# EAGLE schematic Node (EAGLE 9.5.2)
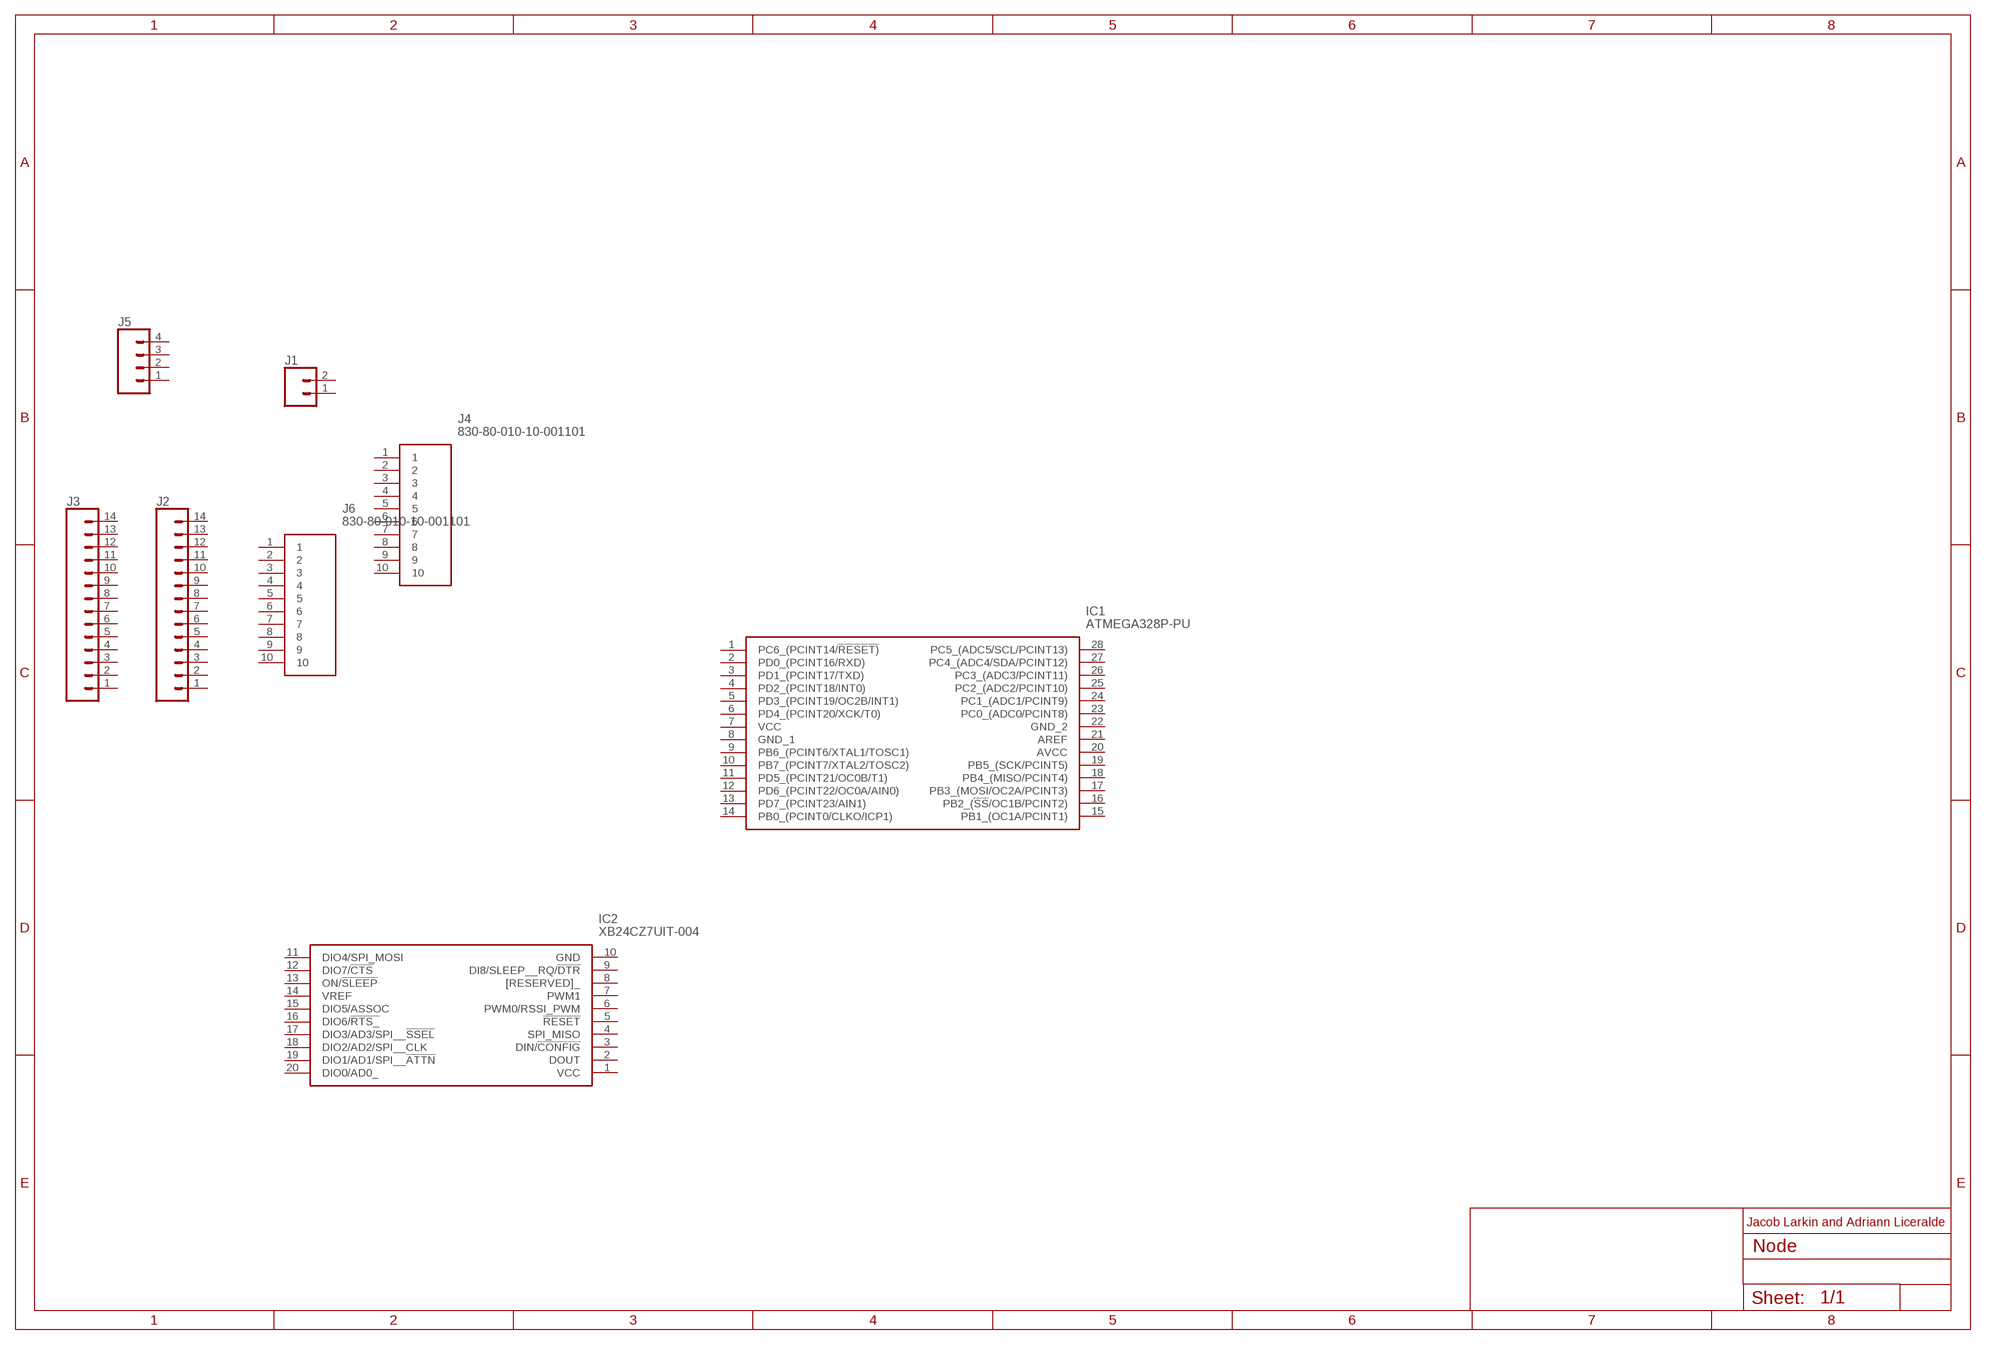
[diagram p0: schematic, sheet 1]

## Parts
IC1  ATMEGA328P-PU  [DIP794W53P254L3467H457Q28N]
IC2  XB24CZ7UIT-004  [XB24CZ7UIT004]
J1  CONN_02JST-PTH-2  [JST-2-PTH]
J2  CONN_14  [1X14]
J3  CONN_14  [1X14]
J4  830-80-010-10-001101  [HDRV10W50P0X200_1X10_2000X220X]
J5  CONN_04JST-PTH  [JST-4-PTH]
J6  830-80-010-10-001101  [HDRV10W50P0X200_1X10_2000X220X]
Unconnected: IC1.1(PC6_(PCINT14/!RESET)) IC1.2(PD0_(PCINT16/RXD)) IC1.3(PD1_(PCINT17/TXD)) IC1.4(PD2_(PCINT18/INT0)) IC1.5(PD3_(PCINT19/OC2B/INT1)) IC1.6(PD4_(PCINT20/XCK/T0)) IC1.7(VCC) IC1.8(GND_1) IC1.9(PB6_(PCINT6/XTAL1/TOSC1)) IC1.10(PB7_(PCINT7/XTAL2/TOSC2)) IC1.11(PD5_(PCINT21/OC0B/T1)) IC1.12(PD6_(PCINT22/OC0A/AIN0)) IC1.13(PD7_(PCINT23/AIN1)) IC1.14(PB0_(PCINT0/CLKO/ICP1)) IC1.15(PB1_(OC1A/PCINT1)) IC1.16(PB2_(!SS!/OC1B/PCINT2)) IC1.17(PB3_(MOSI/OC2A/PCINT3)) IC1.18(PB4_(MISO/PCINT4)) IC1.19(PB5_(SCK/PCINT5)) IC1.20(AVCC) IC1.21(AREF) IC1.22(GND_2) IC1.23(PC0_(ADC0/PCINT8)) IC1.24(PC1_(ADC1/PCINT9)) IC1.25(PC2_(ADC2/PCINT10)) IC1.26(PC3_(ADC3/PCINT11)) IC1.27(PC4_(ADC4/SDA/PCINT12)) IC1.28(PC5_(ADC5/SCL/PCINT13)) IC2.1(VCC) IC2.2(DOUT) IC2.3(DIN/!CONFIG) IC2.4(SPI_MISO) IC2.5(!RESET) IC2.6(PWM0/RSSI_PWM) IC2.7(PWM1) IC2.8([RESERVED]_) IC2.9(DI8/SLEEP__RQ/!DTR) IC2.10(GND) IC2.11(DIO4/SPI_MOSI) IC2.12(DIO7/!CTS) IC2.13(ON/!SLEEP) IC2.14(VREF) IC2.15(DIO5/ASSOC) IC2.16(DIO6/!RTS_) IC2.17(DIO3/AD3/SPI__!SSEL) IC2.18(DIO2/AD2/SPI__CLK) IC2.19(DIO1/AD1/SPI__!ATTN) IC2.20(DIO0/AD0_) J1.1 J1.2 J2.1 J2.2 J2.3 J2.4 J2.5 J2.6 J2.7 J2.8 J2.9 J2.10 J2.11 J2.12 J2.13 J2.14 J3.1 J3.2 J3.3 J3.4 J3.5 J3.6 J3.7 J3.8 J3.9 J3.10 J3.11 J3.12 J3.13 J3.14 J4.1 J4.2 J4.3 J4.4 J4.5 J4.6 J4.7 J4.8 J4.9 J4.10 J5.1 J5.2 J5.3 J5.4 J6.1 J6.2 J6.3 J6.4 J6.5 J6.6 J6.7 J6.8 J6.9 J6.10

## Notes on the sheet
- Jacob Larkin and Adriann Liceralde

## Library data of the parts
IC1 = SamacSys_Parts:ATMEGA328P-PU: MICROCHIP - ATMEGA328P-PU. - MICROCONTROLLER MCU, 8 BIT, ATMEGA, 20MHZ, DIP-28 Source: Datasheet <http://ww1.microchip.com/downloads/en/DeviceDoc/Atmel-42735-8-bit-AVR-Microcontroller-ATmega328-328P_Datasheet.pdf>; ALLIED_NUMBER: 70332157; ALLIED_PRICE-STOCK: https://www.alliedelec.com/microchiptechnologyinc-atmega328p-pu/70332157/; DESCRIPTION: MICROCHIP - ATMEGA328P-PU. - MICROCONTROLLER MCU, 8 BIT, ATMEGA, 20MHZ, DIP-28; HEIGHT: 4.572mm; MANUFACTURER_NAME: Microchip; MANUFACTURER_PART_NUMBER: ATMEGA328P-PU; MOUSER_PART_NUMBER: 556-ATMEGA328P-PU; MOUSER_PRICE-STOCK: https://www.mouser.com/Search/Refine.aspx?Keyword=556-ATMEGA328P-PU; RS_PART_NUMBER: 9222142P; RS_PRICE-STOCK: http://uk.rs-online.com/web/p/products/9222142P
IC2 = SamacSys_Parts:XB24CZ7UIT-004: DIGI INTERNATIONAL - XB24CZ7UIT-004 - RF Transceiver Module, DSSS Modulation, 250Kbps, 2.4GHz, -102dBm, 2.1V to 3.6V, SPI, UART Source: Datasheet <https://componentsearchengine.com/Datasheets/1/XB24CZ7UIT-004.pdf>; DESCRIPTION: DIGI INTERNATIONAL - XB24CZ7UIT-004 - RF Transceiver Module, DSSS Modulation, 250Kbps, 2.4GHz, -102dBm, 2.1V to 3.6V, SPI, UART; HEIGHT: 7.874mm; MANUFACTURER_NAME: Digi International; MANUFACTURER_PART_NUMBER: XB24CZ7UIT-004; MOUSER_PART_NUMBER: 888-XB24CZ7UIT-004; MOUSER_PRICE-STOCK: https://www.mouser.com/Search/Refine.aspx?Keyword=888-XB24CZ7UIT-004
J1 = SparkFun-Connectors:CONN_02: Multi connection point. Often used as Generic Header-pin footprint for 0.1 inch spaced/style header connections On any of the 0.1 inch spaced packages, you can populate with these: Break Away Headers - Straight <https://www.sparkfun.com/products/116> (PRT-00116) Break Away Male Headers - Right Angle <https://www.sparkfun.com/products/553> (PRT-00553) Female Headers <https://www.sparkfun.com/products/115> (PRT-00115) Break Away Headers - Machine Pin <https://www.sparkfun.com/products/117> (PRT-00117) Break Away Female Headers - Swiss Machine Pin <https://www.sparkfun.com/products/743> (PRT-00743) For SCREWTERMINALS and SPRING TERMINALS visit here: Screw Terimnals on SparkFun.com <https://www.sparkfun.com/search/results?term=Screw+Terminals> (5mm/3.5mm/2.54mm spacing) This device is also useful as a general connection point to wire up your design to another part of your project. Our various solder wires solder well into these plated through hole pads. Hook-Up Wire - Assortment (Stranded, 22 AWG) <https://www.sparkfun.com/products/11375> (PRT-11375) Hook-Up Wire - Assortment (Solid Core, 22 AWG) <https://www.sparkfun.com/products/11367> (PRT-11367) View the entire wire category on our website here <https://www.sparkfun.com/categories/141> Special notes: Molex polarized connector foot print use with: PRT-08233 with associated crimp pins and housings. 2.54_SCREWTERM for use with PRT-10571. 3.5mm Screw Terminal footprints for PRT-08084 5mm Screw Terminal footprints for use with PRT-08432; PROD_ID: CONN-09863; SKU: PRT-09914
J2 J3 = SparkFun-Connectors:CONN_14: Multi connection point. Often used as Generic Header-pin footprint for 0.1 inch spaced/style header connections On any of the 0.1 inch spaced packages, you can populate with these: Break Away Headers - Straight <https://www.sparkfun.com/products/116> (PRT-00116) Break Away Male Headers - Right Angle <https://www.sparkfun.com/products/553> (PRT-00553) Female Headers <https://www.sparkfun.com/products/115> (PRT-00115) Break Away Headers - Machine Pin <https://www.sparkfun.com/products/117> (PRT-00117) Break Away Female Headers - Swiss Machine Pin <https://www.sparkfun.com/products/743> (PRT-00743) For SCREWTERMINALS and SPRING TERMINALS visit here: Screw Terimnals on SparkFun.com <https://www.sparkfun.com/search/results?term=Screw+Terminals> (5mm/3.5mm/2.54mm spacing) This device is also useful as a general connection point to wire up your design to another part of your project. Our various solder wires solder well into these plated through hole pads. Hook-Up Wire - Assortment (Stranded, 22 AWG) <https://www.sparkfun.com/products/11375> (PRT-11375) Hook-Up Wire - Assortment (Solid Core, 22 AWG) <https://www.sparkfun.com/products/11367> (PRT-11367) View the entire wire category on our website here <https://www.sparkfun.com/categories/141> Special notes: Molex polarized connector foot print use with SKU : PRT-08231 with associated crimp pins and housings. 1MM SMD Version SKU: PRT-10208 NOTES ON THE VARIANTS LOCK and LOCK_LONGPADS... This footprint was designed to help hold the alignment of a through-hole component (i.e. 6-pin header) while soldering it into place. You may notice that each hole has been shifted either up or down by 0.005 of an inch from it's more standard position (which is a perfectly straight line). This slight alteration caused the pins (the squares in the middle) to touch the edges of the holes. Because they are alternating, it causes a "brace" to hold the component in place. 0.005 has proven to be the perfect amount of "off-center" position when using our standard breakaway headers. Although looks a little odd when you look at the bare footprint, once you have a header in there, the alteration is very hard to notice. Also,if you push a header all the way into place, it is covered up entirely on the bottom side.
J4 J6 = SamacSys_Parts:830-80-010-10-001101: Preci-Dip 2mm 10 Way 1 Row Straight Through Hole Male Connector Strip Source: Datasheet <http://it.rs-online.com/web/p/file-di-contatti-maschio-e-femmina-da-pcb/7019874/>; DESCRIPTION: Preci-Dip 2mm 10 Way 1 Row Straight Through Hole Male Connector Strip; HEIGHT: 7.1mm; MANUFACTURER_NAME: Preci-Dip; MANUFACTURER_PART_NUMBER: 830-80-010-10-001101; MOUSER_PART_NUMBER: 437-8308001010001101; MOUSER_PRICE-STOCK: https://www.mouser.com/Search/Refine.aspx?Keyword=437-8308001010001101; RS_PART_NUMBER: 7019874; RS_PRICE-STOCK: https://uk.rs-online.com/web/p/products/7019874
J5 = SparkFun-Connectors:CONN_04: Multi connection point. Often used as Generic Header-pin footprint for 0.1 inch spaced/style header connections On any of the 0.1 inch spaced packages, you can populate with these: Break Away Headers - Straight <https://www.sparkfun.com/products/116> (PRT-00116) Break Away Male Headers - Right Angle <https://www.sparkfun.com/products/553> (PRT-00553) Female Headers <https://www.sparkfun.com/products/115> (PRT-00115) Break Away Headers - Machine Pin <https://www.sparkfun.com/products/117> (PRT-00117) Break Away Female Headers - Swiss Machine Pin <https://www.sparkfun.com/products/743> (PRT-00743) For SCREWTERMINALS and SPRING TERMINALS visit here: Screw Terimnals on SparkFun.com <https://www.sparkfun.com/search/results?term=Screw+Terminals> (5mm/3.5mm/2.54mm spacing) This device is also useful as a general connection point to wire up your design to another part of your project. Our various solder wires solder well into these plated through hole pads. Hook-Up Wire - Assortment (Stranded, 22 AWG) <https://www.sparkfun.com/products/11375> (PRT-11375) Hook-Up Wire - Assortment (Solid Core, 22 AWG) <https://www.sparkfun.com/products/11367> (PRT-11367) View the entire wire category on our website here <https://www.sparkfun.com/categories/141> Special notes: Molex polarized connector foot print use with SKU : PRT-08231 with associated crimp pins and housings. 1MM SMD Version SKU: PRT-10208; PROD_ID: WIRE-13531; SF_ID: PRT-09916